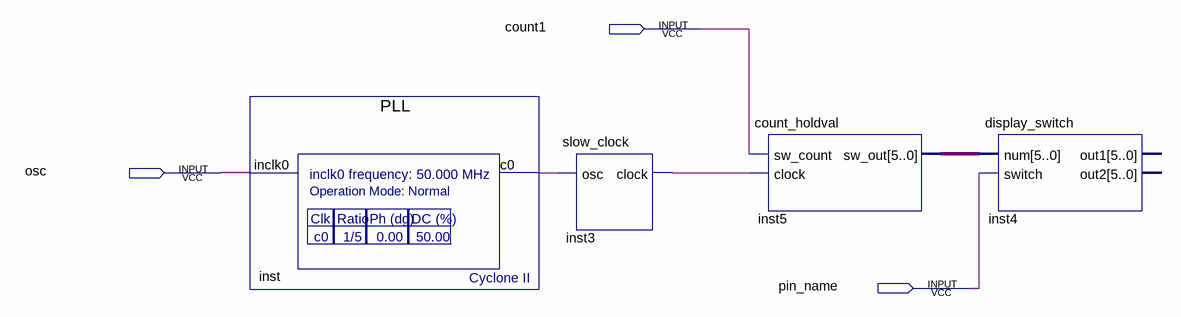
[diagram p0: schematic sheet]
// Quartus schematic switch_display.bdf as structural Verilog: 4 symbols, 3 pins
module switch_display (
  input  count1,
  input  osc,
  input  pin_name
);

  wire inst3_clock, inst_c0;
  wire [5:0] inst5_sw_out;

  PLL inst (.inclk0(osc), .c0(inst_c0));
  slow_clock inst3 (.osc(inst_c0), .clock(inst3_clock));
  count_holdval inst5 (.sw_count(count1), .clock(inst3_clock), .sw_out(inst5_sw_out));
  display_switch inst4 (.num(inst5_sw_out), .switch(pin_name));  // open: out1, out2
endmodule
